# Altium project CRD25DA12N-FMC V1-1 (07-2023).PrjPcb (part 7 of 8)

## Sheet 07 - Current Sense.SchDoc: Current Sense - 25kW WolfPACK FM3 Six-Pack Inv.
size 431 x 279 mm; Date: 07/2023; DocumentNumber: CRD25DA12N-FMC; Revision: 1.1; SheetNumber: 7; SheetTotal: 8; SheetSize: B
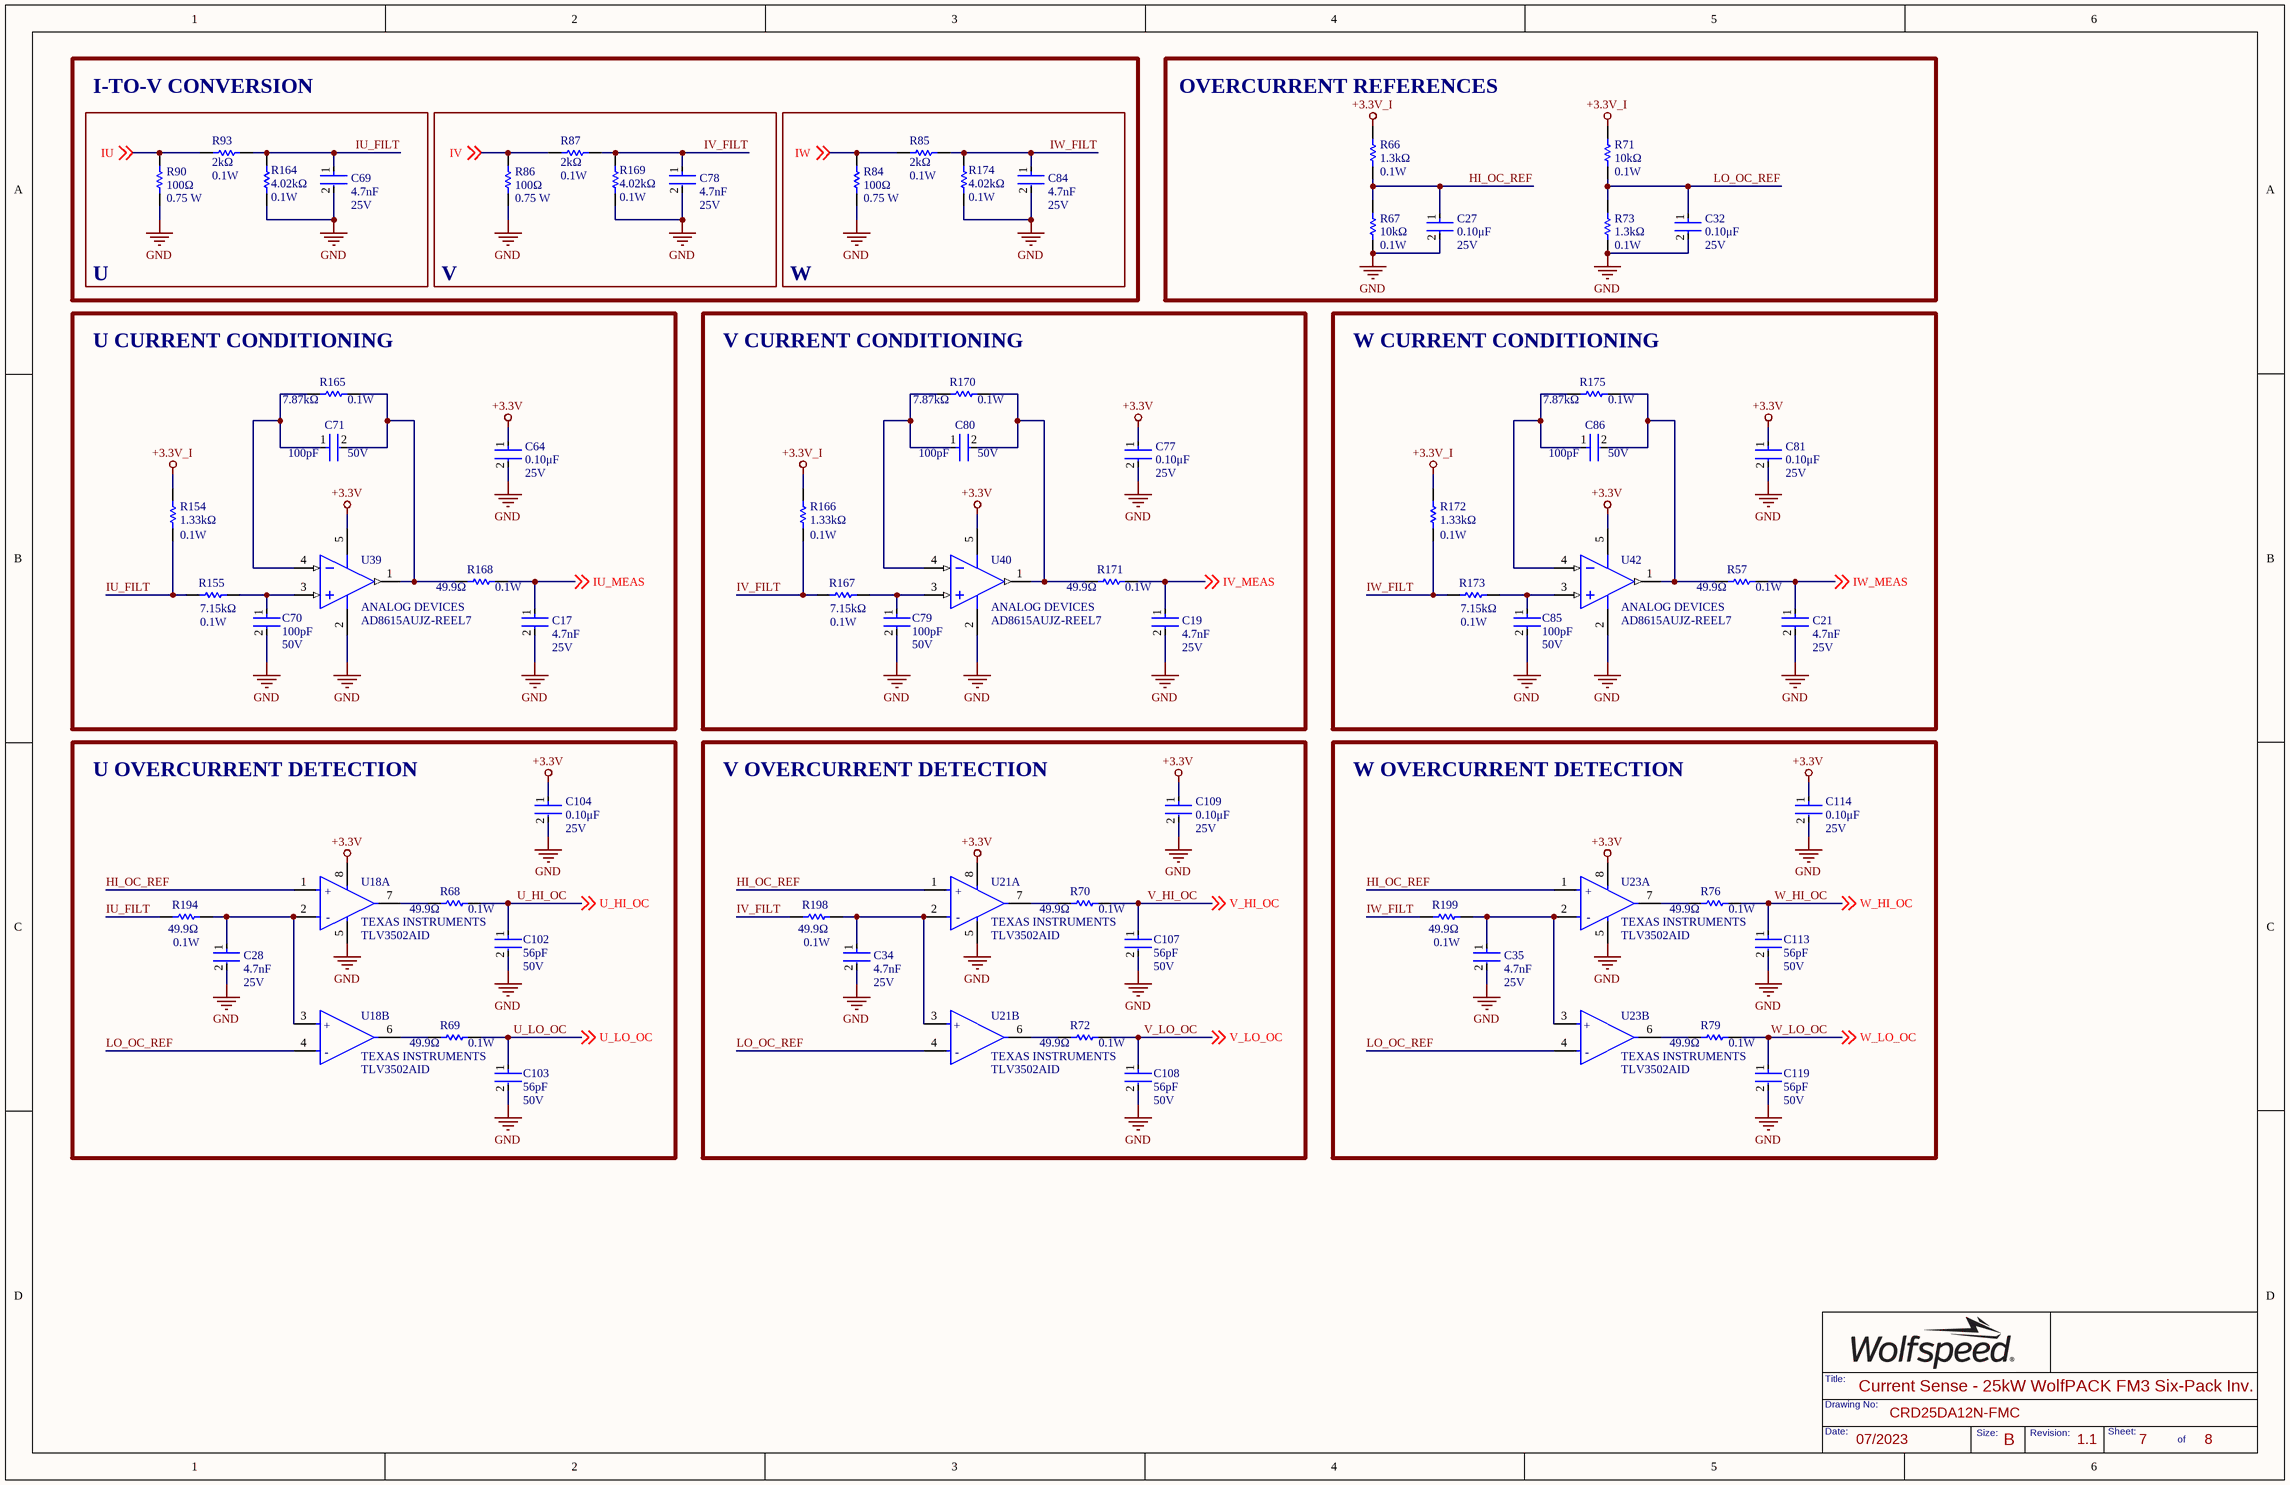
[diagram p6: 07 - Current Sense.SchDoc]

### Parts
C17  Voltage Rating: 25V  Capacitance: 4.7nF  [FP-C0603C-CF-IPC_B]  (hidden comment: C0603C472K3RAC7867)
C19  Voltage Rating: 25V  Capacitance: 4.7nF  [FP-C0603C-CF-IPC_B]  (hidden comment: C0603C472K3RAC7867)
C21  Voltage Rating: 25V  Capacitance: 4.7nF  [FP-C0603C-CF-IPC_B]  (hidden comment: C0603C472K3RAC7867)
C27  Voltage Rating: 25V  Capacitance: 0.10μF  [FP-C0603C-CF-IPC_B]  (hidden comment: C0603C104K3RACTU)
C28  Voltage Rating: 25V  Capacitance: 4.7nF  [FP-C0603C-CF-IPC_B]  (hidden comment: C0603C472K3RAC7867)
C32  Voltage Rating: 25V  Capacitance: 0.10μF  [FP-C0603C-CF-IPC_B]  (hidden comment: C0603C104K3RACTU)
C34  Voltage Rating: 25V  Capacitance: 4.7nF  [FP-C0603C-CF-IPC_B]  (hidden comment: C0603C472K3RAC7867)
C35  Voltage Rating: 25V  Capacitance: 4.7nF  [FP-C0603C-CF-IPC_B]  (hidden comment: C0603C472K3RAC7867)
C64  Voltage Rating: 25V  Capacitance: 0.10μF  [FP-C0603C-CF-IPC_B]  (hidden comment: C0603C104K3RACTU)
C69  Voltage Rating: 25V  Capacitance: 4.7nF  [FP-C0603C-CF-IPC_B]  (hidden comment: C0603C472K3RAC7867)
C70  Capacitance: 100pF  Voltage: 50V  [FP-C0603C-CF-IPC_B]  (hidden comment: CL10C101JB8NNNC)
C71  Capacitance: 100pF  Voltage: 50V  [FP-C0603C-CF-IPC_B]  (hidden comment: CL10C101JB8NNNC)
C77  Voltage Rating: 25V  Capacitance: 0.10μF  [FP-C0603C-CF-IPC_B]  (hidden comment: C0603C104K3RACTU)
C78  Voltage Rating: 25V  Capacitance: 4.7nF  [FP-C0603C-CF-IPC_B]  (hidden comment: C0603C472K3RAC7867)
C79  Capacitance: 100pF  Voltage: 50V  [FP-C0603C-CF-IPC_B]  (hidden comment: CL10C101JB8NNNC)
C80  Capacitance: 100pF  Voltage: 50V  [FP-C0603C-CF-IPC_B]  (hidden comment: CL10C101JB8NNNC)
C81  Voltage Rating: 25V  Capacitance: 0.10μF  [FP-C0603C-CF-IPC_B]  (hidden comment: C0603C104K3RACTU)
C84  Voltage Rating: 25V  Capacitance: 4.7nF  [FP-C0603C-CF-IPC_B]  (hidden comment: C0603C472K3RAC7867)
C85  Capacitance: 100pF  Voltage: 50V  [FP-C0603C-CF-IPC_B]  (hidden comment: CL10C101JB8NNNC)
C86  Capacitance: 100pF  Voltage: 50V  [FP-C0603C-CF-IPC_B]  (hidden comment: CL10C101JB8NNNC)
C102  Capacitance: 56pF  Voltage Rating: 50V  [FP-C0603C-CF-IPC_B]  (hidden comment: CL10C560JB8NNNC)
C103  Capacitance: 56pF  Voltage Rating: 50V  [FP-C0603C-CF-IPC_B]  (hidden comment: CL10C560JB8NNNC)
C104  Voltage Rating: 25V  Capacitance: 0.10μF  [FP-C0603C-CF-IPC_B]  (hidden comment: C0603C104K3RACTU)
C107  Capacitance: 56pF  Voltage Rating: 50V  [FP-C0603C-CF-IPC_B]  (hidden comment: CL10C560JB8NNNC)
C108  Capacitance: 56pF  Voltage Rating: 50V  [FP-C0603C-CF-IPC_B]  (hidden comment: CL10C560JB8NNNC)
C109  Voltage Rating: 25V  Capacitance: 0.10μF  [FP-C0603C-CF-IPC_B]  (hidden comment: C0603C104K3RACTU)
C113  Capacitance: 56pF  Voltage Rating: 50V  [FP-C0603C-CF-IPC_B]  (hidden comment: CL10C560JB8NNNC)
C114  Voltage Rating: 25V  Capacitance: 0.10μF  [FP-C0603C-CF-IPC_B]  (hidden comment: C0603C104K3RACTU)
C119  Capacitance: 56pF  Voltage Rating: 50V  [FP-C0603C-CF-IPC_B]  (hidden comment: CL10C560JB8NNNC)
R57  Resistance: 49.9Ω  Power Rating: 0.1W  [FP-MCR03-IPC_B]  (hidden comment: ERJ-3EKF49R9V)
R66  Power Rating: 0.1W  Resistance: 1.3kΩ  [FP-MCR03-IPC_B]  (hidden comment: ERA3AEB132V)
R67  Resistance: 10kΩ  Max Power Dissipation: 0.1W  [FP-MCR03-IPC_B]  (hidden comment: ERJ3EKF1002V)
R68  Resistance: 49.9Ω  Power Rating: 0.1W  [FP-MCR03-IPC_B]  (hidden comment: ERJ-3EKF49R9V)
R69  Resistance: 49.9Ω  Power Rating: 0.1W  [FP-MCR03-IPC_B]  (hidden comment: ERJ-3EKF49R9V)
R70  Resistance: 49.9Ω  Power Rating: 0.1W  [FP-MCR03-IPC_B]  (hidden comment: ERJ-3EKF49R9V)
R71  Resistance: 10kΩ  Max Power Dissipation: 0.1W  [FP-MCR03-IPC_B]  (hidden comment: ERJ3EKF1002V)
R72  Resistance: 49.9Ω  Power Rating: 0.1W  [FP-MCR03-IPC_B]  (hidden comment: ERJ-3EKF49R9V)
R73  Power Rating: 0.1W  Resistance: 1.3kΩ  [FP-MCR03-IPC_B]  (hidden comment: ERA3AEB132V)
R76  Resistance: 49.9Ω  Power Rating: 0.1W  [FP-MCR03-IPC_B]  (hidden comment: ERJ-3EKF49R9V)
R79  Resistance: 49.9Ω  Power Rating: 0.1W  [FP-MCR03-IPC_B]  (hidden comment: ERJ-3EKF49R9V)
R84  value 100Ω  Power: 0.75 W  [RESC2010(5025)_N]  (hidden comment: RC2010FK-07100RL)
R85  Resistance: 2kΩ  Power Rating: 0.1W  [FP-MCR03-IPC_B]  (hidden comment: RT0603DRE072KL)
R86  value 100Ω  Power: 0.75 W  [RESC2010(5025)_N]  (hidden comment: RC2010FK-07100RL)
R87  Resistance: 2kΩ  Power Rating: 0.1W  [FP-MCR03-IPC_B]  (hidden comment: RT0603DRE072KL)
R90  value 100Ω  Power: 0.75 W  [RESC2010(5025)_N]  (hidden comment: RC2010FK-07100RL)
R93  Resistance: 2kΩ  Power Rating: 0.1W  [FP-MCR03-IPC_B]  (hidden comment: RT0603DRE072KL)
R154  Power Rating: 0.1W  Resistance: 1.33kΩ  [FP-MCR03-IPC_B]  (hidden comment: RMCF0603FT1K33)
R155  Resistance: 7.15kΩ  Power Rating: 0.1W  [FP-MCR03-IPC_B]  (hidden comment: RMCF0603FT7K15)
R164  Resistance: 4.02kΩ  Power Rating: 0.1W  [FP-MCR03-IPC_B]  (hidden comment: ERA3AEB4021V)
R165  Resistance: 7.87kΩ  Max Power Dissipation: 0.1W  [FP-MCR03-IPC_B]  (hidden comment: RC0603FR-077K87L)
R166  Power Rating: 0.1W  Resistance: 1.33kΩ  [FP-MCR03-IPC_B]  (hidden comment: RMCF0603FT1K33)
R167  Resistance: 7.15kΩ  Power Rating: 0.1W  [FP-MCR03-IPC_B]  (hidden comment: RMCF0603FT7K15)
R168  Resistance: 49.9Ω  Power Rating: 0.1W  [FP-MCR03-IPC_B]  (hidden comment: ERJ-3EKF49R9V)
R169  Resistance: 4.02kΩ  Power Rating: 0.1W  [FP-MCR03-IPC_B]  (hidden comment: ERA3AEB4021V)
R170  Resistance: 7.87kΩ  Max Power Dissipation: 0.1W  [FP-MCR03-IPC_B]  (hidden comment: RC0603FR-077K87L)
R171  Resistance: 49.9Ω  Power Rating: 0.1W  [FP-MCR03-IPC_B]  (hidden comment: ERJ-3EKF49R9V)
R172  Power Rating: 0.1W  Resistance: 1.33kΩ  [FP-MCR03-IPC_B]  (hidden comment: RMCF0603FT1K33)
R173  Resistance: 7.15kΩ  Power Rating: 0.1W  [FP-MCR03-IPC_B]  (hidden comment: RMCF0603FT7K15)
R174  Resistance: 4.02kΩ  Power Rating: 0.1W  [FP-MCR03-IPC_B]  (hidden comment: ERA3AEB4021V)
R175  Resistance: 7.87kΩ  Max Power Dissipation: 0.1W  [FP-MCR03-IPC_B]  (hidden comment: RC0603FR-077K87L)
R194  Resistance: 49.9Ω  Power Rating: 0.1W  [FP-MCR03-IPC_B]  (hidden comment: ERJ-3EKF49R9V)
R198  Resistance: 49.9Ω  Power Rating: 0.1W  [FP-MCR03-IPC_B]  (hidden comment: ERJ-3EKF49R9V)
R199  Resistance: 49.9Ω  Power Rating: 0.1W  [FP-MCR03-IPC_B]  (hidden comment: ERJ-3EKF49R9V)
U18  TLV3502AID  Manufacturer Print: TEXAS INSTRUMENTS  [FP-D0008A-IPC_B]  (parts A,B of 2)
U21  TLV3502AID  Manufacturer Print: TEXAS INSTRUMENTS  [FP-D0008A-IPC_B]  (parts A,B of 2)
U23  TLV3502AID  Manufacturer Print: TEXAS INSTRUMENTS  [FP-D0008A-IPC_B]  (parts A,B of 2)
U39  Manufacturer: ANALOG DEVICES  [ADI-UJ-5_M]  (hidden comment: AD8615AUJZ-REEL7)
U40  Manufacturer: ANALOG DEVICES  [ADI-UJ-5_M]  (hidden comment: AD8615AUJZ-REEL7)
U42  Manufacturer: ANALOG DEVICES  [ADI-UJ-5_M]  (hidden comment: AD8615AUJZ-REEL7)

### Blocks framed on the sheet
V: C78 R86 R87 R169
W: C84 R84 R85 R174
OVERCURRENT REFERENCES: C27 C32 R66 R67 R71 R73
U CURRENT CONDITIONING: C17 C64 C70 C71 R154 R155 R165 R168 U39
V CURRENT CONDITIONING: C19 C77 C79 C80 R166 R167 R170 R171 U40
W CURRENT CONDITIONING: C21 C81 C85 C86 R57 R172 R173 R175 U42
U OVERCURRENT DETECTION: C28 C102-C104 R68 R69 R194 U18
V OVERCURRENT DETECTION: C34 C107-C109 R70 R72 R198 U21
W OVERCURRENT DETECTION: C35 C113 C114 C119 R76 R79 R199 U23

### Nets
+3.3V: C64.1 C77.1 C81.1 C104.1 C109.1 C114.1 U18.8(V+) U21.8(V+) U23.8(V+) U39.5(+V) U40.5(+V) U42.5(+V)
+3.3V_I: R66.2 R71.2 R154.2 R166.2 R172.2
GND: C17.2 C19.2 C21.2 C27.2 C28.2 C32.2 C34.2 C35.2 C64.2 C69.2 C70.2 C77.2 C78.2 C79.2 C81.2 C84.2 C85.2 C102.2 C103.2 C104.2 C107.2 C108.2 C109.2 C113.2 C114.2 C119.2 R67.1 R73.1 R84.1 R86.1 R90.1 R164.1 R169.1 R174.1 U18.5(V-) U21.5(V-) U23.5(V-) U39.2(-V) U40.2(-V) U42.2(-V)
HI_OC_REF: C27.1 R66.1 R67.2 U18.1(+IN_A) U21.1(+IN_A) U23.1(+IN_A)
IU: R90.2 R93.1 ; off-sheet IU
IU_FILT: C69.1 R93.2 R154.1 R155.1 R164.2 R194.1
IU_MEAS: C17.1 R168.2 ; off-sheet IU_MEAS
IV: R86.2 R87.1 ; off-sheet IV
IV_FILT: C78.1 R87.2 R166.1 R167.1 R169.2 R198.1
IV_MEAS: C19.1 R171.2 ; off-sheet IV_MEAS
IW: R84.2 R85.1 ; off-sheet IW
IW_FILT: C84.1 R85.2 R172.1 R173.1 R174.2 R199.1
IW_MEAS: C21.1 R57.2 ; off-sheet IW_MEAS
LO_OC_REF: C32.1 R71.1 R73.2 U18.4(-IN_B) U21.4(-IN_B) U23.4(-IN_B)
U_HI_OC: C102.1 R68.2 ; off-sheet U_HI_OC
U_LO_OC: C103.1 R69.2 ; off-sheet U_LO_OC
V_HI_OC: C107.1 R70.2 ; off-sheet V_HI_OC
V_LO_OC: C108.1 R72.2 ; off-sheet V_LO_OC
W_HI_OC: C113.1 R76.2 ; off-sheet W_HI_OC
W_LO_OC: C119.1 R79.2 ; off-sheet W_LO_OC
NetC28_1: C28.1 R194.2 U18.2(-IN_A) U18.3(+IN_B)
NetC34_1: C34.1 R198.2 U21.2(-IN_A) U21.3(+IN_B)
NetC35_1: C35.1 R199.2 U23.2(-IN_A) U23.3(+IN_B)
NetC70_1: C70.1 R155.2 U39.3(+IN)
NetC71_1: C71.1 R165.1 U39.4(-IN)
NetC71_2: C71.2 R165.2 R168.1 U39.1(OUT)
NetC79_1: C79.1 R167.2 U40.3(+IN)
NetC80_1: C80.1 R170.1 U40.4(-IN)
NetC80_2: C80.2 R170.2 R171.1 U40.1(OUT)
NetC85_1: C85.1 R173.2 U42.3(+IN)
NetC86_1: C86.1 R175.1 U42.4(-IN)
NetC86_2: C86.2 R57.1 R175.2 U42.1(OUT)
NetR68_1: R68.1 U18.7(OUT_A)
NetR69_1: R69.1 U18.6(OUT_B)
NetR70_1: R70.1 U21.7(OUT_A)
NetR72_1: R72.1 U21.6(OUT_B)
NetR76_1: R76.1 U23.7(OUT_A)
NetR79_1: R79.1 U23.6(OUT_B)

### Notes on the sheet
- I-TO-V CONVERSION
- U
- Title:
- Date:
- Drawing No:
- Size:
- Revision:
- Sheet:
- of
- (in symbol CMP-04896-000023-1, part A) +; -
- (in symbol CMP-04896-000023-1, part B) +; -

### Library data of the parts
C17 C19 C21 C28 C34 C35 C69 C78 C84 = C0603C472K3RAC7867: CAP CER 4700PF 25V 10% X7R 0603; Manufacturer: KEMET; Manufacturer Part Number: C0603C472K3RACTU; Dielectric Material: Ceramic; Value: 4.7nF; Supplier 1: Newark; RoHS: Yes; Category: Ceramic Capacitors; Stock 1: 8000; Pricing 1: 1=0.04800, 4000=0.04800 (USD); Mount: Surface Mount; Package: 0603; Case Code (Metric): 1608; Case Code (Imperial): 0603; Min Operating Temperature: -55°C; Max Operating Temperature: 125°C; Tolerance: 10%; Dielectric: X7R; Packaging: Tape and Reel; Package Quantity: 1; Voltage Rating (DC): 25V; Termination: SMD/SMT; Dissipation Factor: 10%; Series: C; Construction: Flat; Length: 1.6mm; Width: 0.031inch; Height: 0.8mm; Thickness: 0.034inch; Lead Pitch: 0.7mm; Depth: 0.8mm; Radiation Hardening: No; Reach SVHC Compliant: Yes; RoHS Compliant: Yes; ComponentLink1URL: https://datasheet.ciiva.com/5414/kem-c1002-x7r-smd-357932-5414293.pdf?src-supplier=Mouser; ComponentLink1Description: https://datasheet.ciiva.com/5414/kem-c1002-x7r-smd-357932-5414293.pdf?src-supplier=Mouser; Supplier Part Number 1: 67AH9250
C27 C32 C64 C77 C81 C104 C109 C114 = CMP-2006-03057-2: CAP CER 0.1UF 25V X7R 0603; Manufacturer: KEMET; Value: 0.10μF; Material: Ceramic; Tolerance: 0.1; Temperature Coefficient: 30ppm/°C; Automotive Grade: Grade 1; Lead Free: Yes; Device Class L3: Ceramic Capacitors; Manufacturer Part Number: C0603C104K3RACTU; Digikey Description: CAP CER 0.1UF 25V X7R 0603; Mouser Description: Multilayer Ceramic Capacitors MLCC - SMD/SMT 25volts 0.1uF X7R 10%; Package: 0603; Temperature Range Low: -55°C; Automotive: Yes; Device Class L2: Capacitors; Octopart: https://octopart.com/c0603c104k3ractu-kemet-127541; ComponentLink2Description: Datasheet; ComponentLink2URL: https://api.kemet.com/component-edge/download/datasheet/C0603C100J5GACAUTO.pdf; Temperature Range High: +125°C; RoHS: TRUE; Device Class L1: Passive Components; Category: Cap; Temperature: -55°C to +125°C; Height: 0.87mm; Temperature Characteristic: X7R
C70 C71 C79 C80 C85 C86 = CL10C101JB8NNNC: CAP CER 100PF 50V C0G/NP0 0603; Manufacturer: SAMSUNG; Material: Ceramic; Tolerance: 5%; Dielectric: C0G; Temperature Coefficient: 300ppm/°C; Supplier 1: Rs; Manufacturer Part Number: CL10C101JB8NNNC; RoHS: Yes; Category: Ceramic Capacitors; Stock 1: 488000; Mount: Surface Mount; Case Code (Metric): 1608; Case Code (Imperial): 0603; Contact Plating: Tin; Min Operating Temperature: -55°C; Max Operating Temperature: 125°C; Voltage Rating (DC): 50V; Packaging: Tape and Reel; Package Quantity: 1; Voltage Rating: 50V; Series: CL; Construction: Flat; Length: 1.6mm; Width: 0.031inch; Height: 0.8mm; Depth: 0.8mm; Thickness: 0.035inch; Radiation Hardening: No; Lead Free: Lead Free; RoHS Compliant: Yes; ComponentLink1URL: https://datasheet.ciiva.com/25782/cl10c101jb8nnnc-25782145.pdf?src-supplier=Digi-Key; ComponentLink1Description: https://datasheet.ciiva.com/25782/cl10c101jb8nnnc-25782145.pdf?src-supplier=Digi-Key; ComponentLink2URL: https://datasheet.ciiva.com/26838/getdatasheetpartid-358356-26838483.pdf?src-supplier=Verical; ComponentLink2Description: https://datasheet.ciiva.com/26838/getdatasheetpartid-358356-26838483.pdf?src-supplier=Verical; ComponentLink3URL: https://datasheet.ciiva.com/29199/456574-da-01-en-vs-kondensator-0603-29199002.pdf?src-supplier=Conrad; ComponentLink3Description: https://datasheet.ciiva.com/29199/456574-da-01-en-vs-kondensator-0603-29199002.pdf?src-supplier=Conrad; ComponentLink4URL: https://datasheet.ciiva.com/26310/mlcc-catalogdownload2013-eng-26310303.pdf?src-supplier=Distrelec; ComponentLink4Description: https://datasheet.ciiva.com/26310/mlcc-catalogdownload2013-eng-26310303.pdf?src-supplier=Distrelec; Supplier Part Number 1: 7665130; Package: 0603; Value: 100pF
C102 C103 C107 C108 C113 C119 = CL10C560JB8NNNC: as C24-C26 on sheet 05 - Gate Drivers; Supplier 1: Arrow Electronics; Manufacturer Part Number: CL10C560JB8NNNC; RoHS: Yes; Category: Ceramic Capacitors; Stock 1: 60182; Pricing 1: 1=0.05960, 10=0.01370, 25=0.01360, 100=0.01080, 250=0.01070, 500=0.00740, 1000=0.00590, 3000=0.00560, 6000=0.00530, 15000=0.00500, 30000=0.00470 (USD); Mount: Surface Mount; Case Code (Metric): 1608; Case Code (Imperial): 0603; Min Operating Temperature: -55°C; Max Operating Temperature: 125°C; Packaging: Tape and Reel; Package Quantity: 1; Voltage: 50V; Voltage Rating (DC): 50V; Series: CL; Construction: Flat; Termination: SMD/SMT; Length: 1.6mm; Width: 0.031inch; Height: 0.8mm; Thickness: 0.035inch; Depth: 0.8mm; Radiation Hardening: No; Lead Free: Lead Free; RoHS Compliant: Yes; ComponentLink1URL: https://datasheet.ciiva.com/25803/cl10c560jb8nnnc-25803592.pdf?src-supplier=Digi-Key; ComponentLink1Description: https://datasheet.ciiva.com/25803/cl10c560jb8nnnc-25803592.pdf?src-supplier=Digi-Key; ComponentLink2URL: https://datasheet.ciiva.com/26838/getdatasheetpartid-640760-26838546.pdf?src-supplier=Verical; ComponentLink2Description: https://datasheet.ciiva.com/26838/getdatasheetpartid-640760-26838546.pdf?src-supplier=Verical; ComponentLink3URL: https://datasheet.ciiva.com/29198/456837-da-01-en-vs-kondensator-0603-29198873.pdf?src-supplier=Conrad; ComponentLink3Description: https://datasheet.ciiva.com/29198/456837-da-01-en-vs-kondensator-0603-29198873.pdf?src-supplier=Conrad; ComponentLink4URL: https://datasheet.ciiva.com/48428/mlcc-catalogdownload2013-eng-48428598.pdf?src-supplier=Distrelec; ComponentLink4Description: https://datasheet.ciiva.com/48428/mlcc-catalogdownload2013-eng-48428598.pdf?src-supplier=Distrelec; ComponentLink5URL: https://datasheet.ciiva.com/16449/cl05b104kq5nnnc-16449527.pdf?src-supplier=Future+Electronics; ComponentLink5Description: https://datasheet.ciiva.com/16449/cl05b104kq5nnnc-16449527.pdf?src-supplier=Future+Electronics; Supplier Part Number 1: CL10C560JB8NNNC; Package: 0603; Value: 56pF
R57 R68-R70 R72 R76 R79 R168 R171 R194 R198 R199 = ERJ-3EKF49R9V: RES SMD 49.9 OHM 1% 1/10W 0603; Manufacturer: PANASONIC; Temperature Coefficient: 100ppm/°C; Voltage Rating: 75V; Max Power Dissipation: 100mW; Voltage Rating (DC): 50V; Working Voltage: 6V; Value: 49.9Ω; Supplier 1: Newark; Manufacturer Part Number: ERJ-3EKF49R9V; RoHS: Yes; Category: Chip SMD Resistors; Stock 1: 670000; Pricing 1: 1=0.00600, 5000=0.00600 (USD); Mount: Surface Mount; Package: 0603; Contact Plating: Tin; Case Code (Imperial): 0603; Case Code (Metric): 1608; Min Operating Temperature: -55°C; Max Operating Temperature: 155°C; Tolerance: 1%; Resistor Type: Thick Film; Packaging: Tape and Reel; Package Quantity: 5000; Number of Terminations: 2; Termination: SMD/SMT; Features: Automotive AEC-Q200; Series: ERJ; Resistance Tolerance: 1%; Construction: Rectangular; Technology: THICK FILM; Length: 1.6mm; Width: 0.8mm; Height: 0.022inch; Depth: 0.8mm; Radiation Hardening: No; Reach SVHC Compliant: Yes; Military Standard: Not; Lead Free: Lead Free; RoHS Compliant: Yes; ComponentLink1URL: https://datasheet.ciiva.com/46388/1678782-46388908.pdf?src-supplier=Element14; ComponentLink1Description: https://datasheet.ciiva.com/46388/1678782-46388908.pdf?src-supplier=Element14; ComponentLink2URL: https://datasheet.ciiva.com/28694/1678782-28694219.pdf?src-supplier=Element14; ComponentLink2Description: https://datasheet.ciiva.com/28694/1678782-28694219.pdf?src-supplier=Element14; ComponentLink3URL: https://datasheet.ciiva.com/16772/70260748-16772570.pdf?src-supplier=Allied+Electronics; ComponentLink3Description: https://datasheet.ciiva.com/16772/70260748-16772570.pdf?src-supplier=Allied+Electronics; ComponentLink4URL: https://datasheet.ciiva.com/16766/70260748-16766262.pdf?src-supplier=Allied+Electronics; ComponentLink4Description: https://datasheet.ciiva.com/16766/70260748-16766262.pdf?src-supplier=Allied+Electronics; ComponentLink5URL: https://datasheet.ciiva.com/9117/aoa0000ce2-9117128.pdf?src-supplier=Avnet; ComponentLink5Description: https://datasheet.ciiva.com/9117/aoa0000ce2-9117128.pdf?src-supplier=Avnet; ComponentLink6URL: https://datasheet.ciiva.com/48531/aoa0000ce2-48531019.pdf?src-supplier=Avnet; ComponentLink6Description: https://datasheet.ciiva.com/48531/aoa0000ce2-48531019.pdf?src-supplier=Avnet; ComponentLink7URL: https://datasheet.ciiva.com/30095/aoa0000ce2-30095355.pdf?src-supplier=Onlinecomponents.com; ComponentLink7Description: https://datasheet.ciiva.com/30095/aoa0000ce2-30095355.pdf?src-supplier=Onlinecomponents.com; Supplier Part Number 1: 12AC1058
R66 R73 = ERA3AEB132V: RES SMD 1.3K OHM 0.1% 1/10W 0603; Manufacturer: PANASONIC; Manufacturer Part Number: ERA-3AEB132V; Temperature Coefficient: 25ppm/°C; Voltage Rating: 75V; Max Power Dissipation: 100mW; Value: 1.3kΩ; Supplier 1: Arrow Electronics; RoHS: Yes; Category: Chip SMD Resistors; Stock 1: 2183; Pricing 1: 1=0.31630, 10=0.27230, 25=0.26980, 100=0.11100, 250=0.10990, 500=0.06700, 1000=0.04610 (USD); Mount: Surface Mount; Package: 0603; Number of Pins: 2; Contact Plating: Tin; Case Code (Metric): 1608; Case Code (Imperial): 0603; Min Operating Temperature: -55°C; Max Operating Temperature: 155°C; Tolerance: 0.1%; Resistor Type: Thin Film; Packaging: Tape and Reel; Package Quantity: 1; Number of Terminations: 2; Termination: SMD/SMT; Voltage Rating (DC): 75V; Features: Automotive AEC-Q200; Series: ERA-3A; Resistance Tolerance: 0.1%; Construction: Rectangular; Technology: THIN FILM; Length: 1.6mm; Width: 0.8mm; Height: 0.45mm; Depth: 0.8mm; Ratings: AEC-Q200; Radiation Hardening: No; Reach SVHC Compliant: Yes; Military Standard: Not; Lead Free: Lead Free; RoHS Compliant: Yes; ComponentLink1URL: https://datasheet.ciiva.com/29183/450807-da-01-en-widerstand-0603-era-29183761.pdf?src-supplier=Conrad; ComponentLink1Description: https://datasheet.ciiva.com/29183/450807-da-01-en-widerstand-0603-era-29183761.pdf?src-supplier=Conrad; ComponentLink2URL: https://datasheet.ciiva.com/6001/485442-6001669.pdf?src-supplier=Farnell; ComponentLink2Description: https://datasheet.ciiva.com/6001/485442-6001669.pdf?src-supplier=Farnell; ComponentLink3URL: https://datasheet.ciiva.com/6001/485442-6001671.pdf?src-supplier=Farnell; ComponentLink3Description: https://datasheet.ciiva.com/6001/485442-6001671.pdf?src-supplier=Farnell; ComponentLink4URL: https://datasheet.ciiva.com/48530/era-eng-tds-48530511.pdf?src-supplier=Distrelec; ComponentLink4Description: https://datasheet.ciiva.com/48530/era-eng-tds-48530511.pdf?src-supplier=Distrelec; ComponentLink5URL: https://datasheet.ciiva.com/48425/era-eng-tds-48425420.pdf?src-supplier=Distrelec; ComponentLink5Description: https://datasheet.ciiva.com/48425/era-eng-tds-48425420.pdf?src-supplier=Distrelec; ComponentLink6URL: https://datasheet.ciiva.com/24069/aoa0000ce26-197354-24069145.pdf?src-supplier=Mouser; ComponentLink6Description: https://datasheet.ciiva.com/24069/aoa0000ce26-197354-24069145.pdf?src-supplier=Mouser; ComponentLink7URL: https://datasheet.ciiva.com/30069/54aoa0000ce26-30069735.pdf?src-supplier=Onlinecomponents.com; ComponentLink7Description: https://datasheet.ciiva.com/30069/54aoa0000ce26-30069735.pdf?src-supplier=Onlinecomponents.com; Supplier Part Number 1: ERA-3AEB132V
R67 R71 = ERJ3EKF1002V: RES SMD 10K OHM 1% 1/10W 0603; Manufacturer: PANASONIC; Manufacturer Part Number: ERJ-3EKF1002V; Temperature Coefficient: 100ppm/°C; Power Rating: 100mW; Voltage Rating: 75V; Value: 10kΩ; Supplier 1: Rs; RoHS: Yes; Category: Chip SMD Resistors; Stock 1: 10000; Mount: Surface Mount; Package: 0603; Number of Pins: 2; Contact Plating: Tin; Case Code (Metric): 1608; Case Code (Imperial): 0603; Size Code: 0603; Min Operating Temperature: -55°C; Max Operating Temperature: 155°C; Tolerance: 1%; Resistor Type: Thick Film; Packaging: Tape and Reel; Package Quantity: 1; Number of Terminations: 2; Termination: SMD/SMT; Voltage Rating (DC): 75V; Features: Automotive AEC-Q200; Series: ERJ; Technology: THICK FILM; Resistance Tolerance: 1%; Construction: Rectangular; Length: 1.6mm; Width: 0.8mm; Height: 0.45mm; Depth: 0.8mm; Radiation Hardening: No; Reach SVHC Compliant: Yes; Military Standard: Not; Lead Free: Lead Free; RoHS Compliant: Yes; ComponentLink1URL: https://datasheet.ciiva.com/7830/aoa0000ce2-7830729.pdf?src-supplier=Element14; ComponentLink1Description: https://datasheet.ciiva.com/7830/aoa0000ce2-7830729.pdf?src-supplier=Element14; ComponentLink2URL: https://datasheet.ciiva.com/46372/1678782-46372725.pdf?src-supplier=Element14; ComponentLink2Description: https://datasheet.ciiva.com/46372/1678782-46372725.pdf?src-supplier=Element14; ComponentLink3URL: https://datasheet.ciiva.com/28514/426256-28514198.pdf?src-supplier=Element14; ComponentLink3Description: https://datasheet.ciiva.com/28514/426256-28514198.pdf?src-supplier=Element14; ComponentLink4URL: https://datasheet.ciiva.com/24070/aoa0000ce2-24070318.pdf?src-supplier=Mouser; ComponentLink4Description: https://datasheet.ciiva.com/24070/aoa0000ce2-24070318.pdf?src-supplier=Mouser; ComponentLink5URL: https://datasheet.ciiva.com/16759/70260748-16759807.pdf?src-supplier=Allied+Electronics; ComponentLink5Description: https://datasheet.ciiva.com/16759/70260748-16759807.pdf?src-supplier=Allied+Electronics; ComponentLink6URL: https://datasheet.ciiva.com/9194/aoa0000ce2-9194199.pdf?src-supplier=Avnet; ComponentLink6Description: https://datasheet.ciiva.com/9194/aoa0000ce2-9194199.pdf?src-supplier=Avnet; ComponentLink7URL: https://datasheet.ciiva.com/48530/aoa0000ce2-48530988.pdf?src-supplier=Avnet; ComponentLink7Description: https://datasheet.ciiva.com/48530/aoa0000ce2-48530988.pdf?src-supplier=Avnet; ComponentLink8URL: https://datasheet.ciiva.com/30208/aoa0000ce2-30208985.pdf?src-supplier=Onlinecomponents.com; ComponentLink8Description: https://datasheet.ciiva.com/30208/aoa0000ce2-30208985.pdf?src-supplier=Onlinecomponents.com; Supplier Part Number 1: 1051156
R84 R86 R90 = CMP-1017-00397-1: RES 100 OHM 1% 3/4W 2010; Manufacturer: YAGEO; Case-Metric: 5025; Package: 2010; Tolerance: 1 %; Technology: SMT; Manufacturer Part Number: RC2010FK-07100RL
R85 R87 R93 = RT0603DRE072KL: RES SMD 2K OHM 0.5% 1/10W 0603; Manufacturer: YAGEO; Temperature Coefficient: 50ppm/°C; Voltage Rating: 75V; Max Power Dissipation: 100mW; Voltage Rating (DC): 50V; Value: 2kΩ; Supplier 1: Future Electronics; Manufacturer Part Number: RT0603DRE072KL; RoHS: Yes; Category: Chip SMD Resistors; Stock 1: 5000; Pricing 1: 5000=0.00650, 20000=0.00620, 75000=0.00590, 125000=0.00580, 250000=0.00550 (USD); Package: 0603; Contact Plating: Tin,Matte; Case Code (Metric): 1608; Case Code (Imperial): 0603; Min Operating Temperature: -55°C; Max Operating Temperature: 125°C; Tolerance: 0.5%; Resistor Type: Thin Film; Packaging: Tape and Reel; Package Quantity: 5000; Number of Terminations: 2; Termination: SMD/SMT; Features: Moisture Resistant; Series: RT; Construction: Rectangular; Length: 0.063inch; Width: 0.031inch; Height: 0.022inch; Depth: 0.8mm; Radiation Hardening: No; Military Standard: Not; Lead Free: Lead Free; RoHS Compliant: Yes; ComponentLink1URL: https://datasheet.ciiva.com/2566/pyu-rt-1-to-0-05-rohs-l-5-2566187.pdf?src-supplier=Digi-Key; ComponentLink1Description: https://datasheet.ciiva.com/2566/pyu-rt-1-to-0-05-rohs-l-5-2566187.pdf?src-supplier=Digi-Key; ComponentLink2URL: https://datasheet.ciiva.com/12705/pyu-rt-1-to-0-05-rohs-l-4-12705391.pdf?src-supplier=Mouser; ComponentLink2Description: https://datasheet.ciiva.com/12705/pyu-rt-1-to-0-05-rohs-l-4-12705391.pdf?src-supplier=Mouser; Supplier Part Number 1: 6165116
R154 R166 R172 = RMCF0603FT1K33: RES 1.33K OHM 1% 1/10W 0603; Manufacturer: STACKPOLE; Max Power Dissipation: 100mW; Temperature Coefficient: 100ppm/°C; Value: 1.33kΩ; Supplier 1: Avnet; Manufacturer Part Number: RMCF0603FT1K33; RoHS: Yes; Category: Chip SMD Resistors; Stock 1: 225000; Pricing 1: 5000=0.00280, 10000=0.00276, 20000=0.00272, 30000=0.00268, 40000=0.00264, 50000=0.00260, 500000=0.00256 (USD); Mount: Surface Mount; Package: 0603; Case Code (Metric): 1608; Case Code (Imperial): 0603; Contact Plating: Tin,Matte; Min Operating Temperature: -55°C; Max Operating Temperature: 155°C; Tolerance: 1%; Packaging: Tape and Reel; Resistor Type: Thick Film; Number of Terminations: 2; Features: Automotive AEC-Q200; Series: RMCF; Length: 0.061inch; Width: 0.031inch; Height: 0.022inch; Radiation Hardening: No; Lead Free: Lead Free; RoHS Compliant: Yes; ComponentLink1URL: https://www.seielect.com/Catalog/SEI-RMCF_RMCP.pdf?src-supplier=Digi-Key; ComponentLink1Description: https://www.seielect.com/Catalog/SEI-RMCF_RMCP.pdf?src-supplier=Digi-Key; ComponentLink2URL: https://www.seielect.com/catalog/SEI-Packaging.pdf?src-supplier=Digi-Key; ComponentLink2Description: https://www.seielect.com/catalog/SEI-Packaging.pdf?src-supplier=Digi-Key; ComponentLink3URL: https://www.seielect.com/catalog/SEI-RMCF_RMCP.pdf?src-supplier=Avnet; ComponentLink3Description: https://www.seielect.com/catalog/SEI-RMCF_RMCP.pdf?src-supplier=Avnet; Supplier Part Number 1: RMCF0603FT1K33
R155 R167 R173 = RMCF0603FT7K15: RES 7.15K OHM 1% 1/10W 0603; Manufacturer: STACKPOLE; Max Power Dissipation: 100mW; Temperature Coefficient: 100ppm/°C; Value: 7.15kΩ; Supplier 1: Avnet; Manufacturer Part Number: RMCF0603FT7K15; RoHS: Yes; Category: Chip SMD Resistors; Stock 1: 135000; Pricing 1: 5000=0.00280, 10000=0.00276, 20000=0.00272, 30000=0.00268, 40000=0.00264, 50000=0.00260, 500000=0.00256 (USD); Mount: Surface Mount; Package: 0603; Case Code (Metric): 1608; Case Code (Imperial): 0603; Contact Plating: Tin,Matte; Size Code: 0603; Min Operating Temperature: -55°C; Max Operating Temperature: 155°C; Tolerance: 1%; Packaging: Tape and Reel; Resistor Type: Thick Film; Number of Terminations: 2; Features: Automotive AEC-Q200; Series: RMCF; Length: 0.061inch; Width: 0.031inch; Height: 0.022inch; Radiation Hardening: No; Lead Free: Lead Free; RoHS Compliant: Yes; ComponentLink1URL: http://components.arrow.com/part/dataview/46949454S9067612N1174?src-supplier=Arrow+Electronics; ComponentLink1Description: http://components.arrow.com/part/dataview/46949454S9067612N1174?src-supplier=Arrow+Electronics; ComponentLink2URL: https://www.seielect.com/catalog/SEI-RMCF_RMCP.pdf?src-supplier=Avnet; ComponentLink2Description: https://www.seielect.com/catalog/SEI-RMCF_RMCP.pdf?src-supplier=Avnet; ComponentLink3URL: https://www.seielect.com/catalog/SEI-Packaging.pdf?src-supplier=Digi-Key; ComponentLink3Description: https://www.seielect.com/catalog/SEI-Packaging.pdf?src-supplier=Digi-Key; ComponentLink4URL: http://www.seielect.com/Catalog/SEI-RMC.pdf?src-supplier=Future+Electronics; ComponentLink4Description: http://www.seielect.com/Catalog/SEI-RMC.pdf?src-supplier=Future+Electronics; Supplier Part Number 1: RMCF0603FT7K15
R164 R169 R174 = ERA3AEB4021V: RES SMD 4.02KOHM 0.1% 1/10W 0603; Manufacturer: PANASONIC; Manufacturer Part Number: ERA-3AEB4021V; Voltage Rating: 75V; Temperature Coefficient: 25ppm/°C; Max Power Dissipation: 100mW; Value: 4.02kΩ; Supplier 1: Rs; RoHS: Yes; Category: Chip SMD Resistors; Stock 1: 890; Mount: Surface Mount; Package: 0603; Number of Pins: 2; Case Code (Metric): 1608; Case Code (Imperial): 0603; Contact Plating: Tin; Min Operating Temperature: -55°C; Max Operating Temperature: 155°C; Tolerance: 0.1%; Packaging: Tape and Reel; Package Quantity: 1; Resistor Type: Thin Film; Number of Terminations: 2; Termination: SMD/SMT; Voltage Rating (DC): 75V; Features: Automotive AEC-Q200; Series: ERA-3A; Construction: Rectangular; Resistance Tolerance: 0.1%; Technology: METAL FILM; Length: 1.6mm; Width: 0.8mm; Height: 0.45mm; Depth: 0.8mm; Radiation Hardening: No; Reach SVHC Compliant: Yes; Military Standard: Not; Lead Free: Lead Free; RoHS Compliant: Yes; ComponentLink1URL: https://datasheet.ciiva.com/29183/452377-da-01-en-widerstand-0603-era-29183994.pdf?src-supplier=Conrad; ComponentLink1Description: https://datasheet.ciiva.com/29183/452377-da-01-en-widerstand-0603-era-29183994.pdf?src-supplier=Conrad; ComponentLink2URL: https://datasheet.ciiva.com/5968/485442-5968885.pdf?src-supplier=Farnell; ComponentLink2Description: https://datasheet.ciiva.com/5968/485442-5968885.pdf?src-supplier=Farnell; ComponentLink3URL: https://datasheet.ciiva.com/5968/485442-5968886.pdf?src-supplier=Farnell; ComponentLink3Description: https://datasheet.ciiva.com/5968/485442-5968886.pdf?src-supplier=Farnell; ComponentLink4URL: https://datasheet.ciiva.com/43457/485442-43457053.pdf?src-supplier=Farnell; ComponentLink4Description: https://datasheet.ciiva.com/43457/485442-43457053.pdf?src-supplier=Farnell; ComponentLink5URL: https://datasheet.ciiva.com/46388/485442-46388217.pdf?src-supplier=Element14; ComponentLink5Description: https://datasheet.ciiva.com/46388/485442-46388217.pdf?src-supplier=Element14; Supplier Part Number 1: 7087616
R165 R170 R175 = RC0603FR-077K87L: RES 7.87K OHM 1% 1/10W 0603; Manufacturer: YAGEO; Power Rating: 100mW; Temperature Coefficient: 100ppm/°C; Voltage Rating: 50V; Value: 7.87kΩ; Supplier 1: Newark; Manufacturer Part Number: RC0603FR-077K87L; RoHS: Yes; Category: Chip SMD Resistors; Stock 1: 12340; Pricing 1: 1=0.10000, 25=0.02000, 50=0.01500, 100=0.00900 (USD); Package: 0603; Case Code (Metric): 1608; Case Code (Imperial): 0603; Size Code: 0603; Min Operating Temperature: -55°C; Max Operating Temperature: 155°C; Tolerance: 1%; Series: RC; Package Quantity: 1; Packaging: Tape and Reel; Resistor Type: Thick Film; Number of Terminations: 2; Termination: SMD/SMT; Voltage Rating (DC): 50V; Features: Moisture Resistant; Construction: Rectangular; Length: 1.6mm; Width: 0.031inch; Height: 0.022inch; Depth: 0.8mm; RoHS Compliant: Yes; Military Standard: Not; Lead Free: Lead Free; ComponentLink1URL: https://datasheet.ciiva.com/2553/pyu-r-int-thick-7-2553552.pdf?src-supplier=Digi-Key; ComponentLink1Description: https://datasheet.ciiva.com/2553/pyu-r-int-thick-7-2553552.pdf?src-supplier=Digi-Key; ComponentLink2URL: https://datasheet.ciiva.com/2553/pyu-r-int-thick-7-2553553.pdf?src-supplier=Digi-Key; ComponentLink2Description: https://datasheet.ciiva.com/2553/pyu-r-int-thick-7-2553553.pdf?src-supplier=Digi-Key; ComponentLink3URL: https://datasheet.ciiva.com/2553/pyu-r-int-thick-7-2553551.pdf?src-supplier=Digi-Key; ComponentLink3Description: https://datasheet.ciiva.com/2553/pyu-r-int-thick-7-2553551.pdf?src-supplier=Digi-Key; Supplier Part Number 1: 49AK2736
U18 U21 U23 = CMP-04896-000023-1: IC COMPARATOR R-R HI-SPD 8-SOIC; Nominal Supply Current: 3.2mA; Standoff Height: 0.11mm; Max Supply Voltage: 5.5V; Min Supply Voltage: 2.2V; Input Bias Current: 0.000002uA; Number Of Channels: 2; Max Junction Temp: +150°C; Input Offset Voltage: 1mV; Automotive: No; Device Class L1: Integrated Circuits (ICs); Lead Free: Yes; Octopart: https://octopart.com/tlv3502aid-texas+instruments-428400; Temperature Range Low: -40°C; ComponentLink2Description: Datasheet; ComponentLink2URL: http://www.ti.com/lit/ds/symlink/tlv3502.pdf; Ambient Temperature Range Low: -40°C; Height: 1.75mm; Manufacturer: TEXAS INSTRUMENTS; Digikey Description: IC COMPARATOR R-R HI-SPD 8-SOIC; Ambient Temperature Range High: +125°C; RoHS: TRUE; Device Class L3: Comparators; Device Class L2: Linear ICs; Temperature: -40°C to +125°C; Manufacturer Part Number: TLV3502AID; Temperature Range High: +125°C; Package: 8-SOIC; Category: IC; Mouser Description: TLV3502AID Texas Instruments, Dual Comparator, Push-Pull O/P, 3 V, 5 V 8-Pin SOIC; Value: N/A
U39 U40 U42 = CMP-0384-02059-2: IC OPAMP GP 1 CIRCUIT TSOT23-5; Generic Part Number: AD8615; Iq/Amp: 1.7mA; V Span Max: 6V; Amplifiers Per Package: 1; Small Signal Bandwidth: 23MHz; Input Offset Voltage: 80uV; V Span Min: 2.7V; Slew Rate: 12V/us; Input Bias Current: 200fA; ComponentLink4URL: http://www.analog.com/en/all-operational-amplifiers-op-amps/operational-amplifiers-op-amps/ad8615/products/product.html#product-recommendations; DatasheetVersion: Rev. E; Code_JEDEC: MO-193-AB; ComponentLink3Description: Package Specification; PackageDescription: 5-Pin Thin Small Outline Transistor Package, Body 2.9 x 1.6 mm, Pitch 0.95 mm; ComponentLink4Description: Reference Circuit; RevisionNote: Reference Circuit URL fixed; ComponentLink1Description: Manufacturer URL; PartNumber: AD8615AUJZ-REEL7; Mounting Technology: Surface Mount; ComponentLink3URL: http:/www.analog.com/static/imported-files/packages/PKG_PDF/TSOT(UJ)/UJ_5.pdf; ComponentLink2URL: http://www.analog.com/static/imported-files/data_sheets/AD8615_8616_8618.pdf; PackageVersion: 100708-A; ComponentLink1URL: http://www.analog.com/en/index.html; ComponentLink2Description: Datasheet; PackageReference: UJ-5; Manufacturer Part Number: AD8615AUJZ-REEL7; Package: TSOT-23-5; Value: N/A